# EAGLE schematic opamp1 (EAGLE 8.4.0)
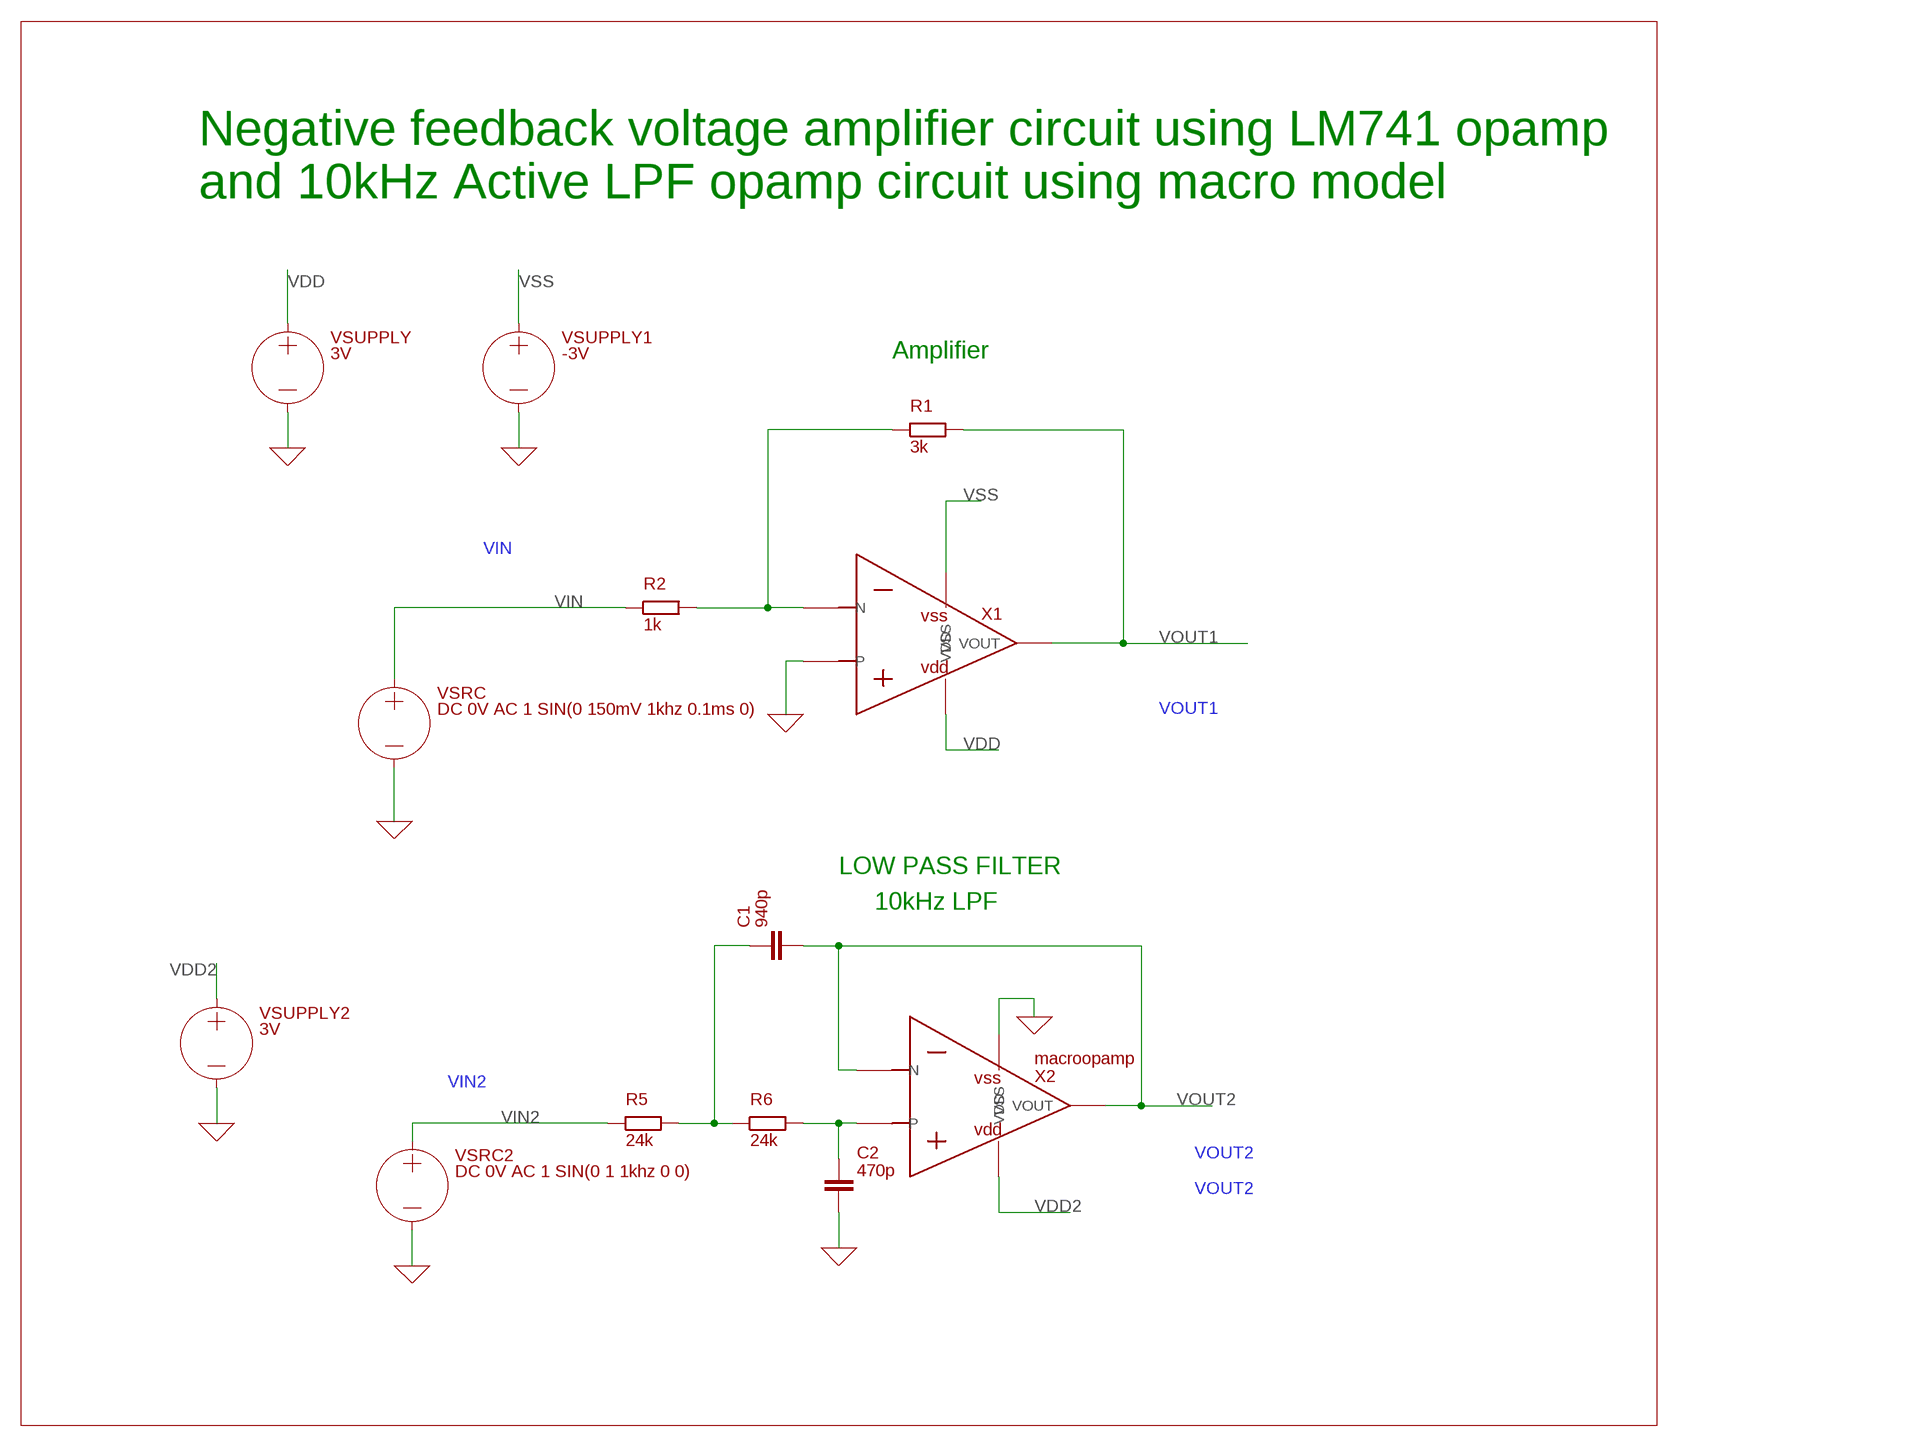
[diagram p0: schematic, sheet 1]

## Parts
C1  940p  C  (no package)
C2  470p  C  (no package)
R1  3k  R  (no package)
R2  1k  R  (no package)
R5  24k  R  (no package)
R6  24k  R  (no package)
VSRC  DC 0V AC 1 SIN(0 150mV 1khz 0.1ms 0)  VOLTAGE  (no package)
VSRC2  DC 0V AC 1 SIN(0 1 1khz 0 0)  VOLTAGE  (no package)
VSUPPLY  3V  VOLTAGE  (no package)
VSUPPLY1  -3V  VOLTAGE  (no package)
VSUPPLY2  3V  VOLTAGE  (no package)
X1  OPAMP  (no package)
X2  OPAMP  (no package)

## Nets
0: C2.2 VSRC2.- VSRC.- VSUPPLY1.- VSUPPLY2.- VSUPPLY.- X1.P X2.VSS ; supply symbol labelled GND
N$1: R1.1 R2.2 X1.N
N$2: C2.1 R6.2 X2.P
N$4: C1.1 R5.2 R6.1
VDD: VSUPPLY.+ X1.VDD
VDD2: VSUPPLY2.+ X2.VDD
VIN: R2.1 VSRC.+
VIN2: R5.1 VSRC2.+
VOUT1: R1.2 X1.VOUT
VOUT2: C1.2 X2.N X2.VOUT
VSS: VSUPPLY1.+ X1.VSS

## Notes on the sheet
- Negative feedback voltage amplifier circuit using LM741 opamp
  and 10kHz Active LPF opamp circuit using macro model
- Amplifier
- LOW PASS FILTER
- 10kHz LPF

## Library data of the parts
C1 C2 = ngspice-simulation:C: CAPACITOR
R1 R2 R5 R6 = ngspice-simulation:R: RESISTOR
VSRC VSRC2 VSUPPLY VSUPPLY1 VSUPPLY2 = ngspice-simulation:VOLTAGE: Independent Voltage Source, either DC, AC, PULSE, SINE, PWL, EXP, or SFFM; VALUE: 0V
X1 = ngspice-simulation:OPAMP: Operational amplifier with power pins
X2 = ngspice-simulation:OPAMP: Operational amplifier with power pins; SPICEMODEL: macroopamp; SPICEPREFIX: X